# Altium schematic sheet RS485.SchDoc
size A4
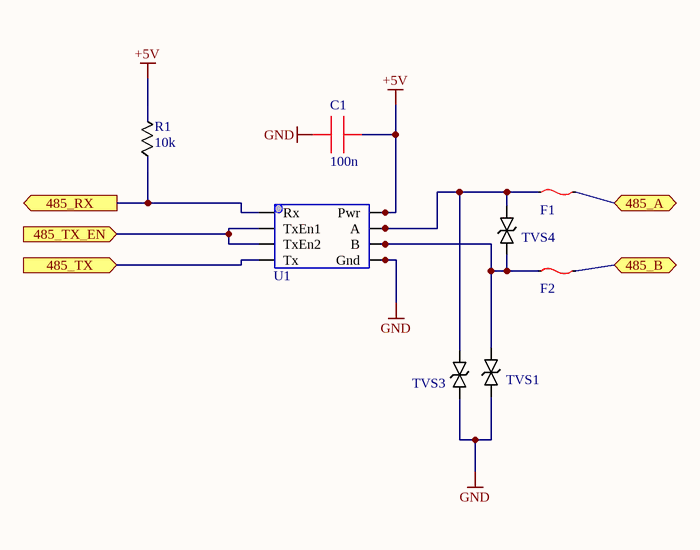
[diagram p0: RS485.SchDoc]

## Parts
C1  100n  [0603_CAP]
F1  Fuse PTS  [1210_MF]  (value not drawn)
F2  Fuse PTS  [1210_MF]  (value not drawn)
R1  10k  [0603_RES]
TVS1  6V  [DO-214AC]  (value not drawn)
TVS3  6V  [DO-214AC]  (value not drawn)
TVS4  6V  [DO-214AC]  (value not drawn)
U1  MAX485  [SOIC 8]  (value not drawn)

## Ports
485_A, 485_B, 485_RX, 485_TX, 485_TX_EN

## Nets
+5V: C1.1 R1.2 U1.8(Pwr)
GND: C1.2 TVS1.1 TVS3.1 U1.5(Gnd)
485_A: F1.2 ; port 485_A
485_B: F2.2 ; port 485_B
485_RX: R1.1 U1.1(Rx) ; port 485_RX
485_TX: U1.4(Tx) ; port 485_TX
485_TX_EN: U1.2(TxEn1) U1.3(TxEn2) ; port 485_TX_EN
NetF1_1: F1.1 TVS3.2 TVS4.2 U1.7(A)
NetF2_1: F2.1 TVS1.2 TVS4.1 U1.6(B)

## Library data of the parts
C1 = 0603 CAP: Part Description: Capacitor 0.1uF X7R 0603 10%; Part Number: CC0603KRX7R9BB104
F1 F2 = MSMF: Part Description: PPTC 60V 100MA; Part Number: MF-MSMF010-2
R1 = Resistor 0805: Part Description: Resistor 0603, 10kOhms, 1%, 1/10W; Part Number: RC0603FR-0710KL
TVS1 TVS3 TVS4 = SMAJ5.0CA: Part Description: TVS Diodes 6volts 800/1600uA 38.8 Amps Bi-Dir; Part Number: SMAJ6.0CA
U1 = MAX485: Part Description: RS-485 Interface IC Low-Power; Part Number: SN65HVD3082EDR